# EasyEDA schematic FoodTag_ADC_Schematic.json
TITLE: Sheet_1; REV: 1.0; Date: 2021-03-16; Sheet: 1/1; Company: Your Company
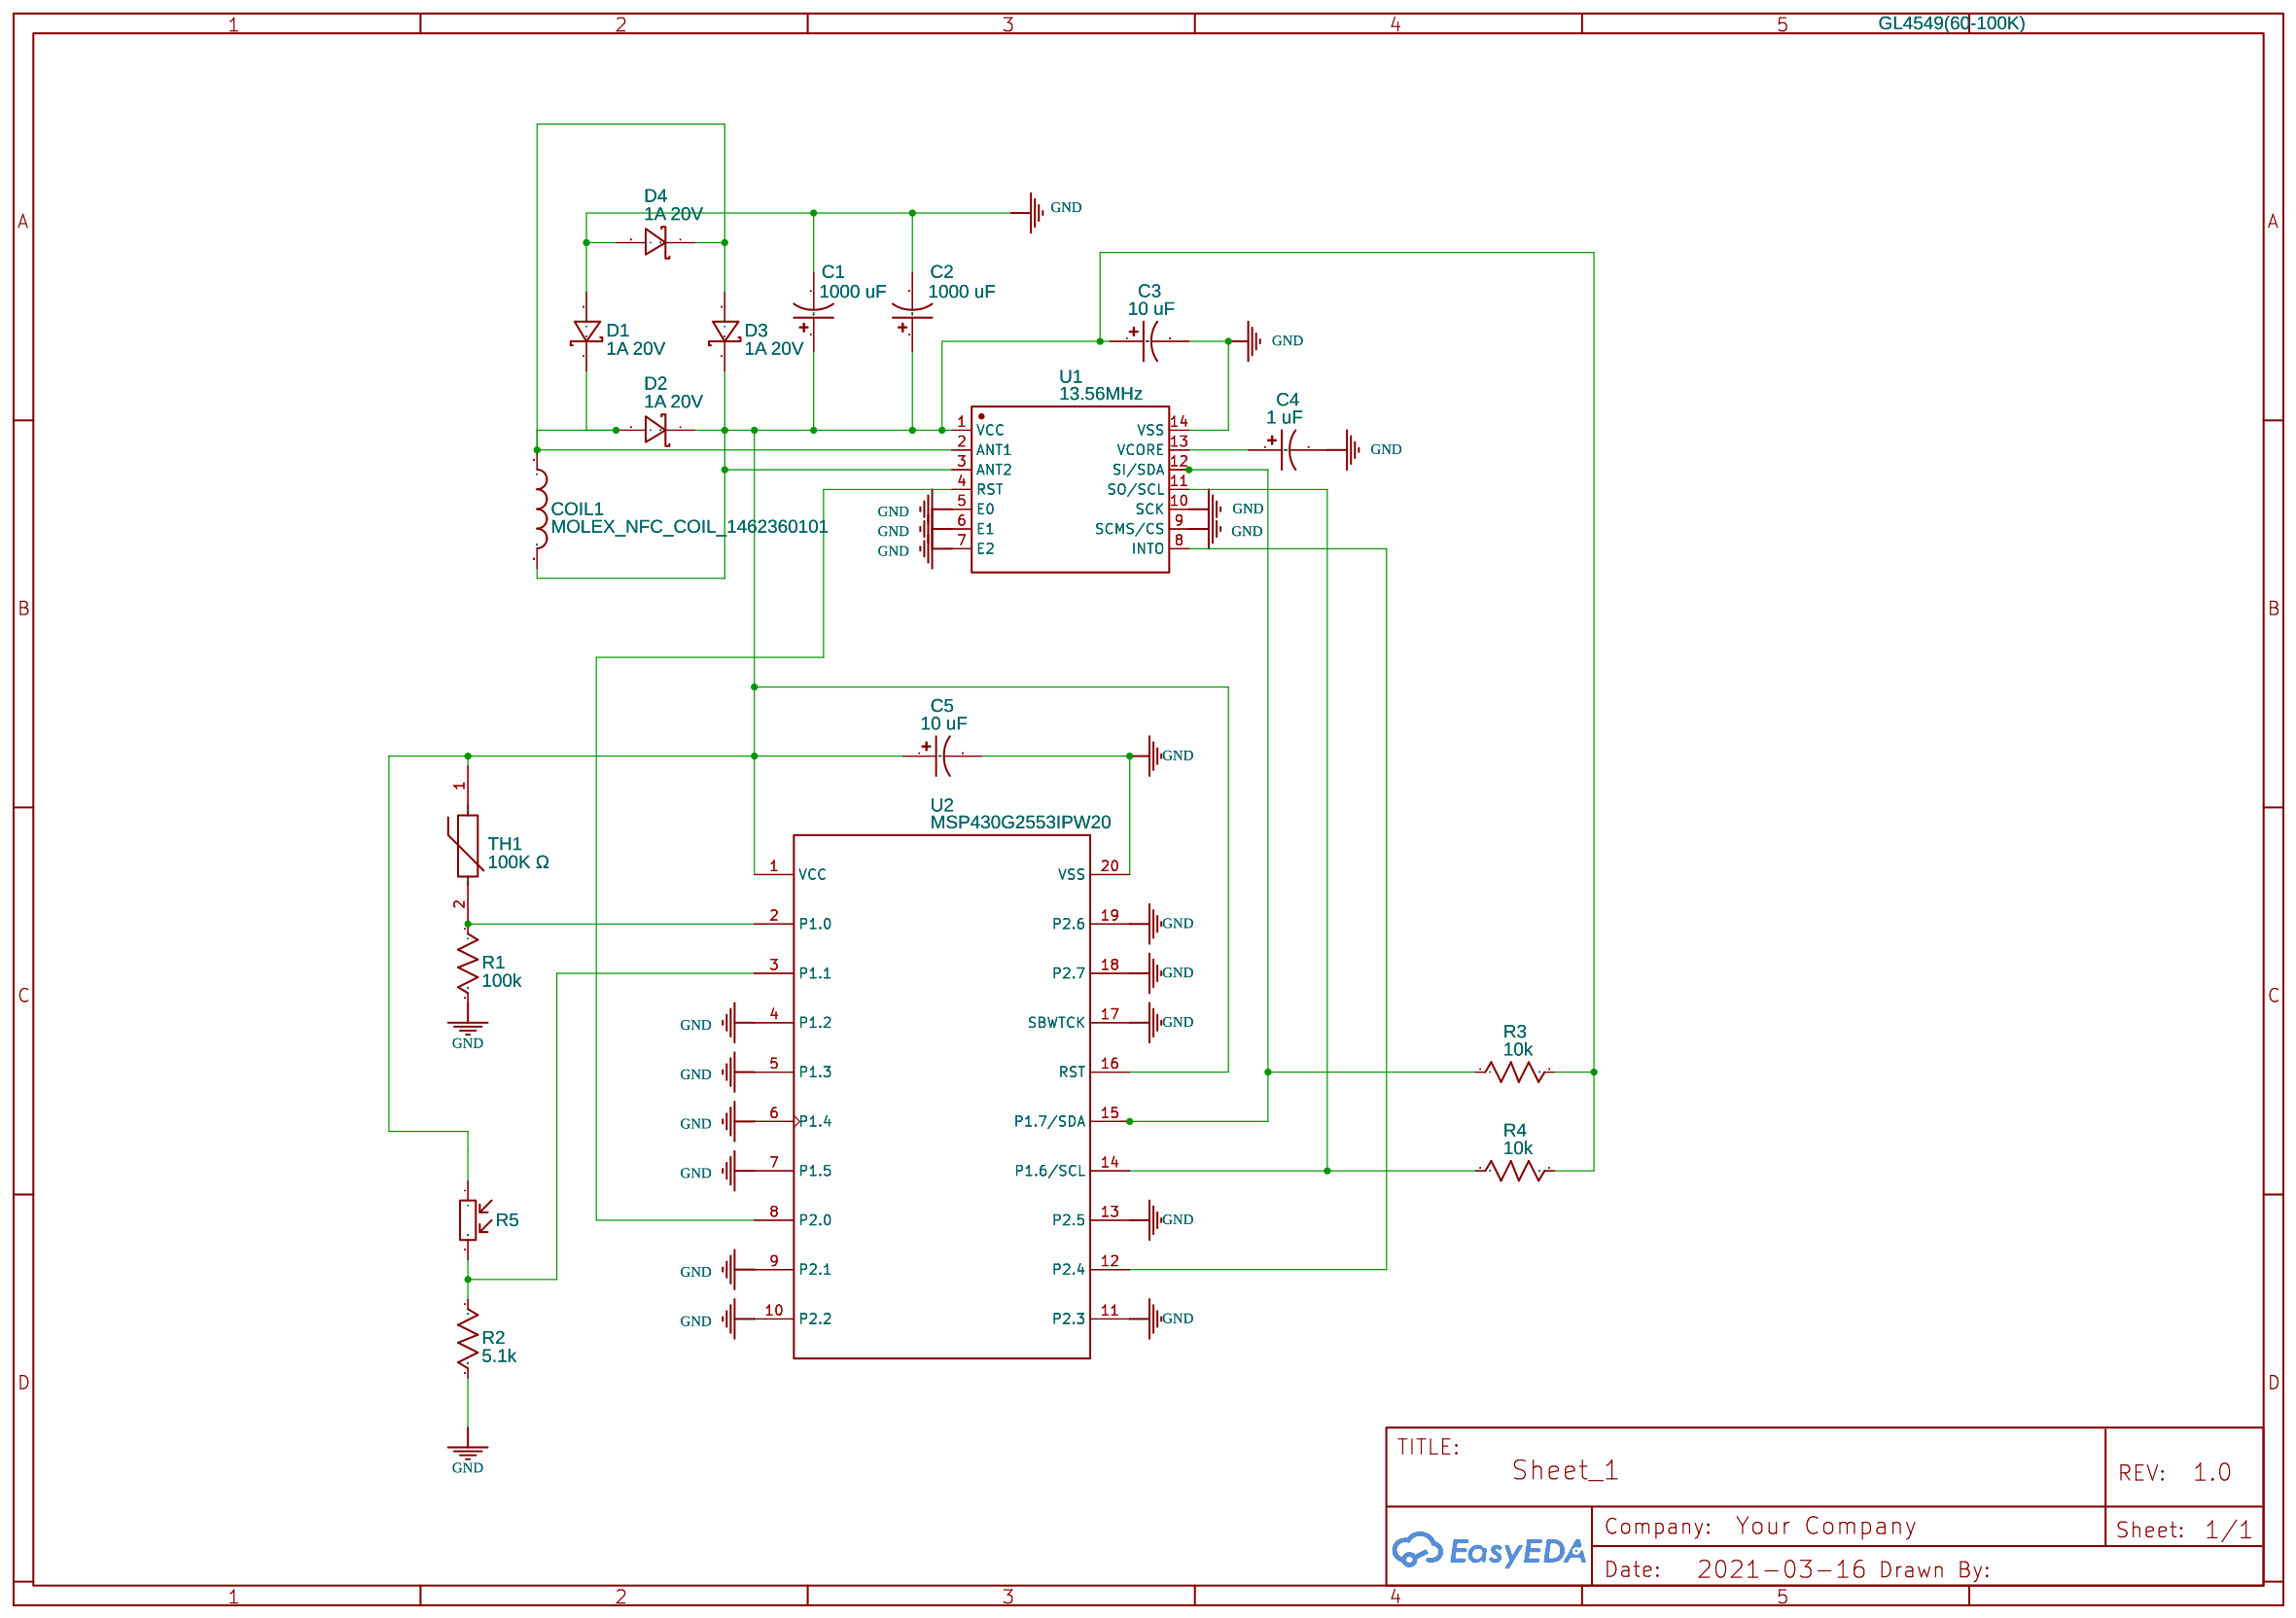
[diagram p0: schematic sheet]

## Parts
C1  1000 uF  [CASE-A_3216]
C2  1000 uF  [CASE-A_3216]
C3  10 uF  [CASE-A_3216]
C4  1 uF  [CASE-A_3216]
C5  10 uF  [CASE-A_3216]
COIL1  MOLEX_NFC_COIL_1462360101  [MOLEX_NFC_COIL1]
D1  1A 20V  [SOD-323_L1.8-W1.3-LS2.5-RD]
D2  1A 20V  [SOD-323_L1.8-W1.3-LS2.5-RD]
D3  1A 20V  [SOD-323_L1.8-W1.3-LS2.5-RD]
D4  1A 20V  [SOD-323_L1.8-W1.3-LS2.5-RD]
R1  100k  [R0603]
R2  5.1k  [R0603]
R3  10k  [R0603]
R4  10k  [R0603]
R5  GL4549(60-100K)  [RES-TH_L5.1-W4.3-P3.40-D0.5]
TH1  100K Ω  [R0805]
U1  13.56MHz  [TSSOP-14_L5.0-W4.4-P0.65-LS6.4-BL]
U2  MSP430G2553IPW20  [TSSOP-20_L6.5-W4.4-P0.65-LS6.4-BL]

## Library data of the parts
C1-C5 = C_Tan_SMD_A_US: Contributor: LCEDA_Lib
COIL1 = MOLEX_NFC_COIL_1462360101: Contributor: George SOROKIN
D1-D4 = PMEG2010EA,115: Supplier: LCSC; Supplier Part: C193668; Manufacturer: Nexperia; Contributor: LCSC
R1-R4 = R_0603_US: Contributor: LCEDA_Lib
R5 = GL4549(60-100K): Supplier: LCSC; Manufacturer: ReliaPro; Supplier Part: C11297
TH1 = NTCS0805E3104FXT: Supplier: LCSC; Manufacturer: VISHAY; Contributor: LCSC; Supplier Part: C143680
U1 = RF430CL330HCPWR: Supplier: LCSC; Manufacturer: TI; Contributor: rmont129; Supplier Part: C130195; SMT Type: Extend; JLCPCB SMD: Yes; LCSC Assembly: Yes; Assembly Type: smtWeld; Paste Type: expand
U2 = MSP430G2553IPW20: Supplier: LCSC; Manufacturer: TI; image: //image.lceda.cn/szlcsc/C53923.jpg; Supplier Part: C53923; SMT Type: Extend; JLCPCB SMD: Yes; LCSC Assembly: Yes; Assembly Type: smtWeld; Paste Type: expand; Contributor: rmont129

## Nets
GND: C1.2 C2.2 C3.2 C4.2 C5.2 D1.2(A) D4.2(A) R1.2 R2.2 U1.5(E0) U1.6(E1) U1.7(E2) U1.9(SCMS/CS) U1.10(SCK) U1.14(VSS) U2.4(P1.2) U2.5(P1.3) U2.6(P1.4) U2.7(P1.5) U2.9(P2.1) U2.10(P2.2) U2.11(P2.3) U2.13(P2.5) U2.17(SBWTCK) U2.18(P2.7) U2.19(P2.6) U2.20(VSS)
Net-(C1-1): C1.1 C2.1 C3.1 C5.1 COIL1.P$2(2) D2.1(C) D3.1(C) R3.2 R4.2 R5.1 TH1.1 U1.1(VCC) U1.3(ANT2) U2.1(VCC) U2.16(RST)
Net-(C4-1): C4.1 U1.13(VCORE)
Net-(COIL1-P$1): COIL1.P$1(1) D1.1(C) D2.2(A) D3.2(A) D4.1(C) U1.2(ANT1)
Net-(R1-1): R1.1 TH1.2 U2.2(P1.0)
Net-(R2-1): R2.1 R5.2 U2.3(P1.1)
Net-(R3-1): R3.1 U1.12(SI/SDA) U2.15(P1.7/SDA)
Net-(R4-1): R4.1 U1.11(SO/SCL) U2.14(P1.6/SCL)
Net-(U1-4): U1.4(RST) U2.8(P2.0)
Net-(U1-8): U1.8(INTO) U2.12(P2.4)
